# EAGLE schematic datapath (EAGLE 9.6.2)
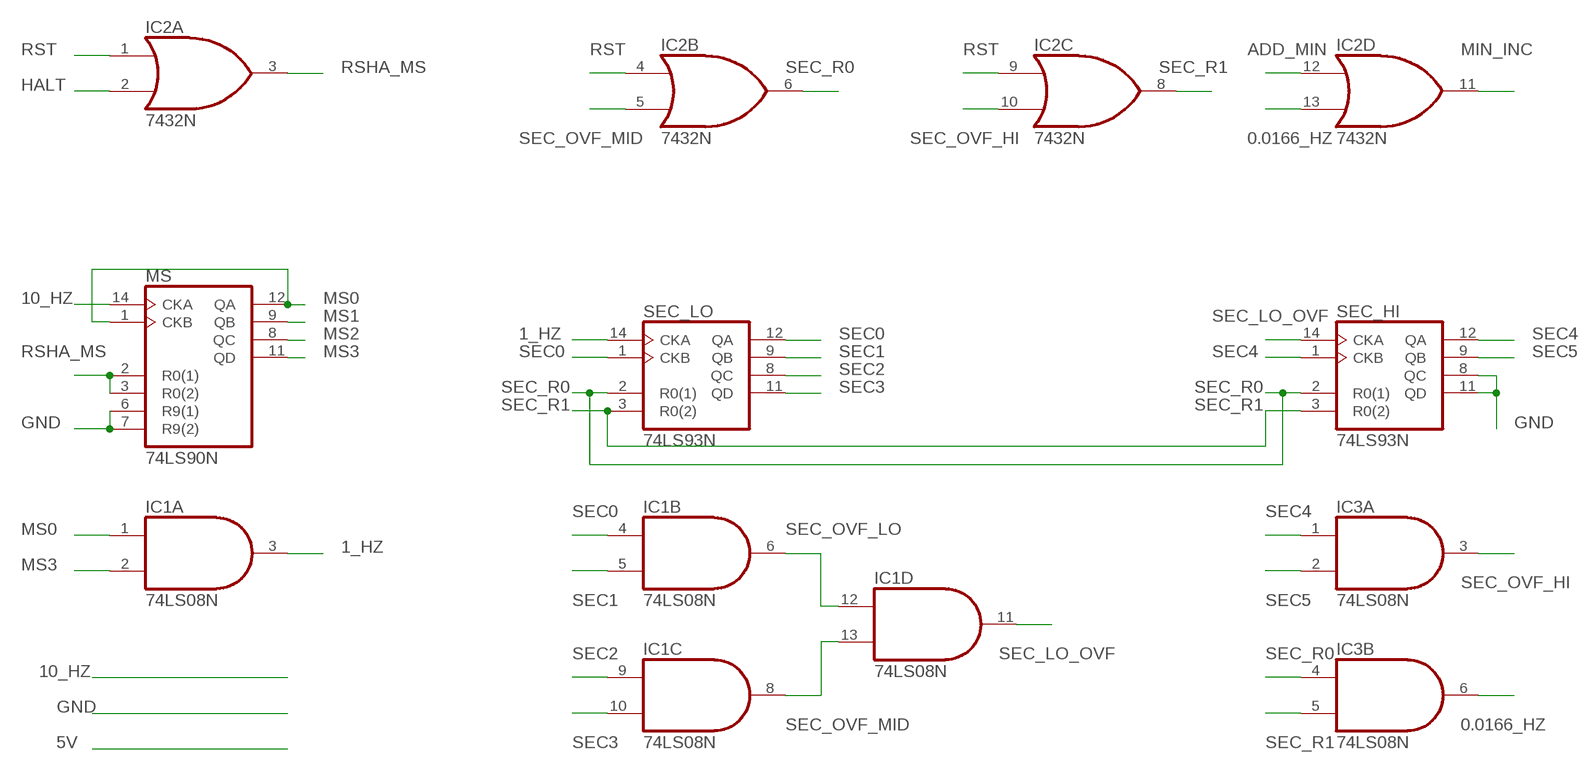
[diagram p0: schematic, sheet 1, part 1 of 2]
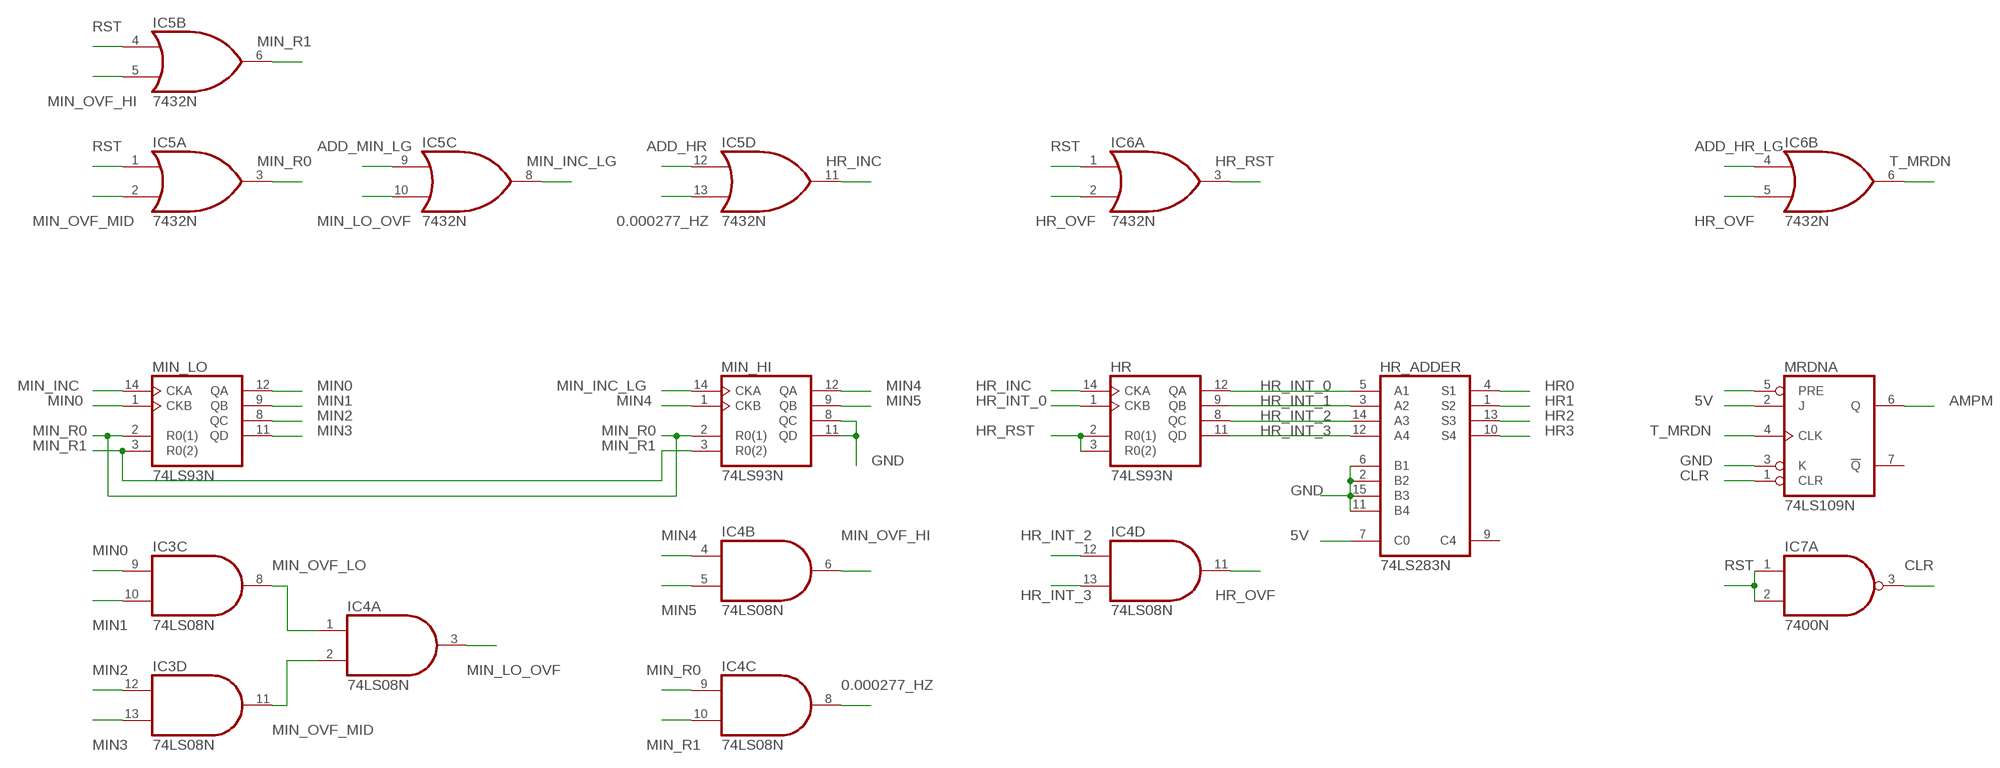
[diagram p1: schematic, sheet 1, part 2 of 2]

## Parts
HR  74LS93N  [DIL14]
HR_ADDER  74LS283N  [DIL16]
IC1  74LS08N  [DIL14]
IC2  7432N  [DIL14]
IC3  74LS08N  [DIL14]
IC4  74LS08N  [DIL14]
IC5  7432N  [DIL14]
IC6  7432N  [DIL14]
IC7  7400N  [DIL14]
MIN_HI  74LS93N  [DIL14]
MIN_LO  74LS93N  [DIL14]
MRDN  74LS109N  [DIL16]
MS  74LS90N  [DIL14]
SEC_HI  74LS93N  [DIL14]
SEC_LO  74LS93N  [DIL14]

## Nets
0.0166_HZ: IC2.13(D:I1) IC3.6(B:O)
0.000277_HZ: IC4.8(C:O) IC5.13(D:I1)
1_HZ: IC1.3(A:O) SEC_LO.14(CKA)
5V: HR_ADDER.7(C0) MRDN.2(A:J)
10_HZ: MS.14(CKA)
ADD_HR: IC5.12(D:I0)
ADD_HR_LG: IC6.4(B:I0)
ADD_MIN: IC2.12(D:I0)
ADD_MIN_LG: IC5.9(C:I0)
AMPM: MRDN.6(A:Q)
CLR: IC7.3(A:O) MRDN.1(A:CLR)
GND: HR_ADDER.2(B2) HR_ADDER.6(B1) HR_ADDER.11(B4) HR_ADDER.15(B3) MIN_HI.8(QC) MIN_HI.11(QD) MRDN.3(A:K) MS.6(R9(1)) MS.7(R9(2)) SEC_HI.8(QC) SEC_HI.11(QD)
HALT: IC2.2(A:I1)
HR0: HR_ADDER.4(S1)
HR1: HR_ADDER.1(S2)
HR2: HR_ADDER.13(S3)
HR3: HR_ADDER.10(S4)
HR_INC: HR.14(CKA) IC5.11(D:O)
HR_INT_0: HR.1(CKB) HR.12(QA) HR_ADDER.5(A1)
HR_INT_1: HR.9(QB) HR_ADDER.3(A2)
HR_INT_2: HR.8(QC) HR_ADDER.14(A3) IC4.12(D:I0)
HR_INT_3: HR.11(QD) HR_ADDER.12(A4) IC4.13(D:I1)
HR_OVF: IC4.11(D:O) IC6.2(A:I1) IC6.5(B:I1)
HR_RST: HR.2(R0(1)) HR.3(R0(2)) IC6.3(A:O)
MIN0: IC3.9(C:I0) MIN_LO.1(CKB) MIN_LO.12(QA)
MIN1: IC3.10(C:I1) MIN_LO.9(QB)
MIN2: IC3.12(D:I0) MIN_LO.8(QC)
MIN3: IC3.13(D:I1) MIN_LO.11(QD)
MIN4: IC4.4(B:I0) MIN_HI.1(CKB) MIN_HI.12(QA)
MIN5: IC4.5(B:I1) MIN_HI.9(QB)
MIN_INC: IC2.11(D:O) MIN_LO.14(CKA)
MIN_INC_LG: IC5.8(C:O) MIN_HI.14(CKA)
MIN_LO_OVF: IC4.3(A:O) IC5.10(C:I1)
MIN_OVF_HI: IC4.6(B:O) IC5.5(B:I1)
MIN_OVF_LO: IC3.8(C:O) IC4.1(A:I0)
MIN_OVF_MID: IC3.11(D:O) IC4.2(A:I1) IC5.2(A:I1)
MIN_R0: IC4.9(C:I0) IC5.3(A:O) MIN_HI.2(R0(1)) MIN_LO.2(R0(1))
MIN_R1: IC4.10(C:I1) IC5.6(B:O) MIN_HI.3(R0(2)) MIN_LO.3(R0(2))
MS0: IC1.1(A:I0) MS.1(CKB) MS.12(QA)
MS1: MS.9(QB)
MS2: MS.8(QC)
MS3: IC1.2(A:I1) MS.11(QD)
N$1: MRDN.5(A:PRE)
RSHA_MS: IC2.3(A:O) MS.2(R0(1)) MS.3(R0(2))
RST: IC2.1(A:I0) IC2.4(B:I0) IC2.9(C:I0) IC5.1(A:I0) IC5.4(B:I0) IC6.1(A:I0) IC7.1(A:I0) IC7.2(A:I1)
SEC0: IC1.4(B:I0) SEC_LO.1(CKB) SEC_LO.12(QA)
SEC1: IC1.5(B:I1) SEC_LO.9(QB)
SEC2: IC1.9(C:I0) SEC_LO.8(QC)
SEC3: IC1.10(C:I1) SEC_LO.11(QD)
SEC4: IC3.1(A:I0) SEC_HI.1(CKB) SEC_HI.12(QA)
SEC5: IC3.2(A:I1) SEC_HI.9(QB)
SEC_LO_OVF: IC1.11(D:O) SEC_HI.14(CKA)
SEC_OVF_HI: IC2.10(C:I1) IC3.3(A:O)
SEC_OVF_LO: IC1.6(B:O) IC1.12(D:I0)
SEC_OVF_MID: IC1.8(C:O) IC1.13(D:I1) IC2.5(B:I1)
SEC_R0: IC2.6(B:O) IC3.4(B:I0) SEC_HI.2(R0(1)) SEC_LO.2(R0(1))
SEC_R1: IC2.8(C:O) IC3.5(B:I1) SEC_HI.3(R0(2)) SEC_LO.3(R0(2))
T_MRDN: IC6.6(B:O) MRDN.4(A:CLK)
Unconnected: HR_ADDER.9(C4) IC6.8(C:O) IC6.9(C:I0) IC6.10(C:I1) IC6.11(D:O) IC6.12(D:I0) IC6.13(D:I1) IC7.4(B:I0) IC7.5(B:I1) IC7.6(B:O) IC7.8(C:O) IC7.9(C:I0) IC7.10(C:I1) IC7.11(D:O) IC7.12(D:I0) IC7.13(D:I1) MRDN.7(A:!Q) MRDN.9(B:!Q) MRDN.10(B:Q) MRDN.11(B:PRE) MRDN.12(B:CLK) MRDN.13(B:K) MRDN.14(B:J) MRDN.15(B:CLR)

## Power pins joined to a net without a drawn wire
GND: HR.10(GND) HR_ADDER.8(GND) IC1.7(P:GND) IC2.7(P:GND) IC3.7(P:GND) IC4.7(P:GND) IC5.7(P:GND) IC6.7(P:GND) IC7.7(P:GND) MIN_HI.10(GND) MIN_LO.10(GND) MRDN.8(P:GND) MS.10(GND) SEC_HI.10(GND) SEC_LO.10(GND)
VCC: HR.5(VCC) HR_ADDER.16(VCC) IC1.14(P:VCC) IC2.14(P:VCC) IC3.14(P:VCC) IC4.14(P:VCC) IC5.14(P:VCC) IC6.14(P:VCC) IC7.14(P:VCC) MIN_HI.5(VCC) MIN_LO.5(VCC) MRDN.16(P:VCC) MS.5(VCC) SEC_HI.5(VCC) SEC_LO.5(VCC)

## Library data of the parts
HR MIN_HI MIN_LO SEC_HI SEC_LO = 74xx-us:74*93: Decade, divide by twelve and binary COUNTER
HR_ADDER = 74xx-us:74*283: 4-bit binary FULL ADDER, fast carry
IC1 IC3 IC4 = 74xx-us:74*08: Quad 2-input AND gate
IC2 IC5 IC6 = 74xx-us:74*32: Quad 2-input OR gate
IC7 = 74xx-us:74*00: Quad 2-input NAND gate
MRDN = 74xx-us:74*109: Dual J-K positive edge triggered FLIP FLOP, preset and clear
MS = 74xx-us:74*90: Decade, divide by twelve and binary COUNTER